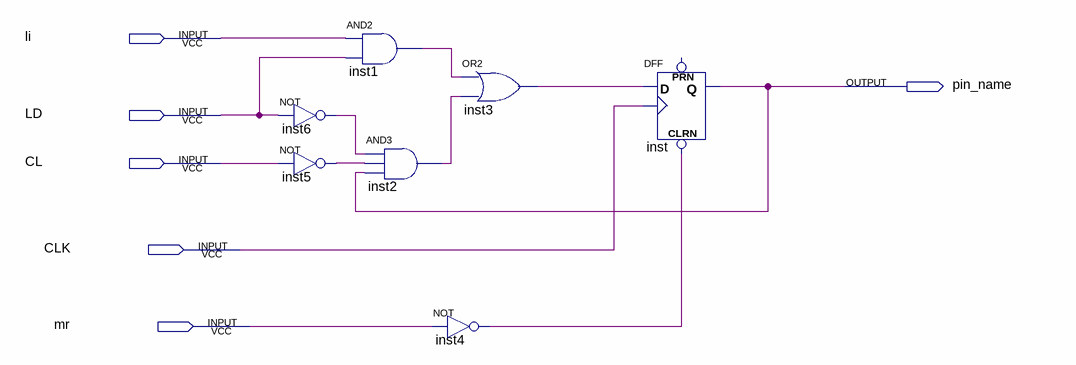
[diagram p0: schematic sheet]
// Quartus schematic REG1_LD_CL.bdf as structural Verilog: 7 symbols, 6 pins
module REG1_LD_CL (
  input  li,
  input  LD,
  input  CL,
  input  CLK,
  input  mr,
  output pin_name
);

  wire inst1_out, inst2_out, inst3_out, inst4_out, inst5_out, inst6_out;

  not inst6 (inst6_out, LD);
  not inst5 (inst5_out, CL);
  and inst1 (inst1_out, li, LD);
  and inst2 (inst2_out, inst6_out, inst5_out, pin_name);
  or inst3 (inst3_out, inst1_out, inst2_out);
  not inst4 (inst4_out, mr);
  DFF inst (.CLRN(inst4_out), .CLK(CLK), .D(inst3_out), .Q(pin_name));  // open: PRN
endmodule
